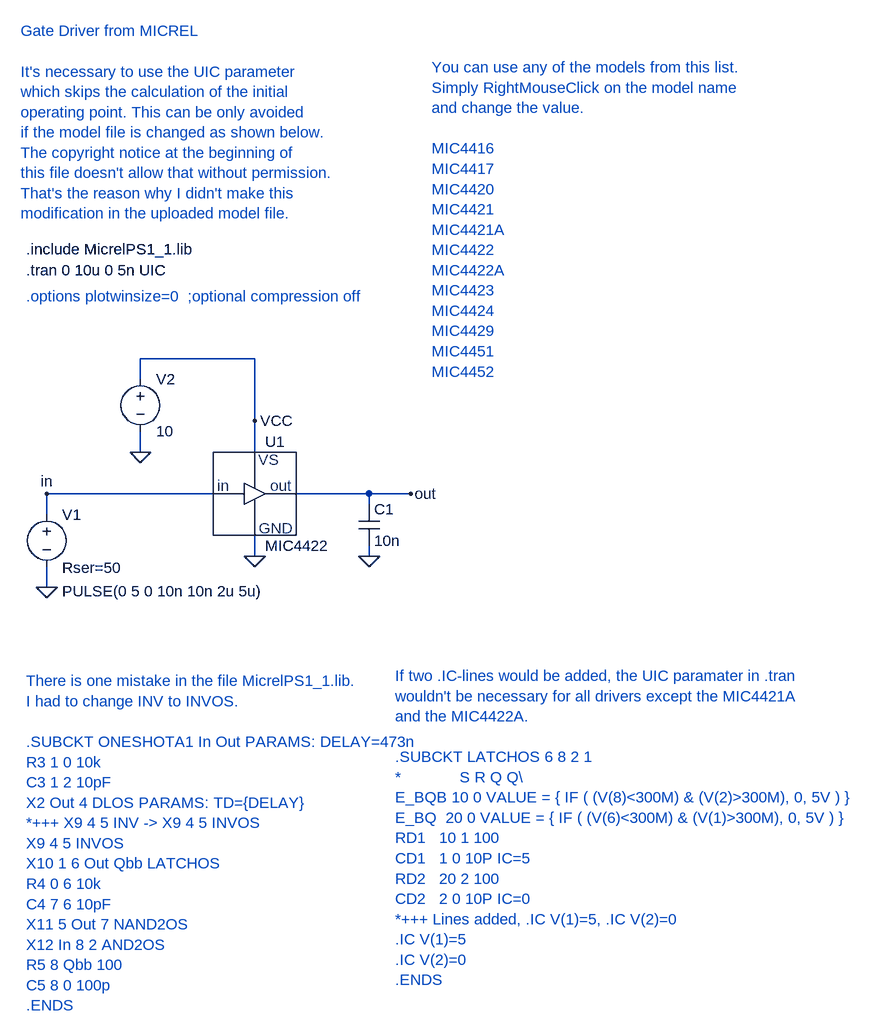
[diagram p0: schematic MIC4422_test.asc]
MIC4422_test.asc, the LTspice schematic file:
Version 4
SHEET 1 1212 960
WIRE -128 240 -128 208
WIRE -128 352 -128 320
WIRE 16 32 16 0
WIRE 16 144 16 112
WIRE 128 208 -128 208
WIRE 192 0 16 0
WIRE 192 96 192 0
WIRE 192 144 192 96
WIRE 192 304 192 272
WIRE 368 208 256 208
WIRE 368 224 368 208
WIRE 368 304 368 288
WIRE 432 208 368 208
FLAG 192 304 0
FLAG 192 96 VCC
FLAG -128 352 0
FLAG 368 304 0
FLAG 432 208 out
FLAG -128 208 in
FLAG 16 144 0
SYMBOL voltage -128 224 R0
WINDOW 3 24 134 Left 0
WINDOW 123 0 0 Left 0
WINDOW 39 24 98 Left 0
SYMATTR Value PULSE(0 5 0 10n 10n 2u 5u)
SYMATTR SpiceLine Rser=50
SYMATTR InstName V1
SYMBOL cap 352 224 R0
SYMATTR InstName C1
SYMATTR Value 10n
SYMBOL voltage 16 16 R0
SYMATTR InstName V2
SYMATTR Value 10
SYMBOL xdriver 192 208 R0
SYMATTR InstName U1
TEXT -160 -168 Left 0 !.include MicrelPS1_1.lib
TEXT -160 -136 Left 0 !.tran 0 10u 0 5n UIC
TEXT 464 -448 Left 0 ;You can use any of the models from this list.\nSimply RightMouseClick on the model name\nand change the value.\n \nMIC4416\nMIC4417\nMIC4420\nMIC4421\nMIC4421A  \nMIC4422\nMIC4422A  \nMIC4423\nMIC4424\nMIC4429\nMIC4451\nMIC4452
TEXT -160 -96 Left 0 ;.options plotwinsize=0  ;optional compression off
TEXT 408 488 Left 0 ;If two .IC-lines would be added, the UIC paramater in .tran \nwouldn't be necessary for all drivers except the MIC4421A \nand the MIC4422A.\n \n.SUBCKT LATCHOS 6 8 2 1\n*             S R Q Q\\\nE_BQB 10 0 VALUE = { IF ( (V(8)<300M) & (V(2)>300M), 0, 5V ) }\nE_BQ  20 0 VALUE = { IF ( (V(6)<300M) & (V(1)>300M), 0, 5V ) }\nRD1   10 1 100\nCD1   1 0 10P IC=5\nRD2   20 2 100\nCD2   2 0 10P IC=0\n*+++ Lines added, .IC V(1)=5, .IC V(2)=0\n.IC V(1)=5\n.IC V(2)=0\n.ENDS
TEXT -160 496 Left 0 ;There is one mistake in the file MicrelPS1_1.lib.\nI had to change INV to INVOS.\n \n.SUBCKT ONESHOTA1 In Out PARAMS: DELAY=473n\nR3 1 0 10k\nC3 1 2 10pF\nX2 Out 4 DLOS PARAMS: TD={DELAY}\n*+++ X9 4 5 INV -> X9 4 5 INVOS\nX9 4 5 INVOS\nX10 1 6 Out Qbb LATCHOS\nR4 0 6 10k\nC4 7 6 10pF\nX11 5 Out 7 NAND2OS\nX12 In 8 2 AND2OS\nR5 8 Qbb 100\nC5 8 0 100p\n.ENDS
TEXT -168 -504 Left 0 ;Gate Driver from MICREL\n \nIt's necessary to use the UIC parameter\nwhich skips the calculation of the initial \noperating point. This can be only avoided\nif the model file is changed as shown below.\nThe copyright notice at the beginning of\nthis file doesn't allow that without permission.\nThat's the reason why I didn't make this \nmodification in the uploaded model file.

The netlist it stands for:
* MIC4422_test.asc
V1 in 0 PULSE(0 5 0 10n 10n 2u 5u) Rser=50
C1 out 0 10n
V2 VCC 0 10
XU1 in out VCC 0 MIC4422  ; pins in out VS VCOM
.include MicrelPS1_1.lib
.tran 0 10u 0 5n UIC
* You can use any of the models from this list.
* Simply RightMouseClick on the model name
* and change the value.
* MIC4416
* MIC4417
* MIC4420
* MIC4421
* MIC4421A
* MIC4422
* MIC4422A
* MIC4423
* MIC4424
* MIC4429
* MIC4451
* MIC4452
* .options plotwinsize=0  ;optional compression off
* If two .IC-lines would be added, the UIC paramater in .tran
* wouldn't be necessary for all drivers except the MIC4421A
* and the MIC4422A.
* .SUBCKT LATCHOS 6 8 2 1
* *             S R Q Q\
* E_BQB 10 0 VALUE = { IF ( (V(8)<300M) & (V(2)>300M), 0, 5V ) }
* E_BQ  20 0 VALUE = { IF ( (V(6)<300M) & (V(1)>300M), 0, 5V ) }
* RD1   10 1 100
* CD1   1 0 10P IC=5
* RD2   20 2 100
* CD2   2 0 10P IC=0
* *+++ Lines added, .IC V(1)=5, .IC V(2)=0
* .IC V(1)=5
* .IC V(2)=0
* .ENDS
* There is one mistake in the file MicrelPS1_1.lib.
* I had to change INV to INVOS.
* .SUBCKT ONESHOTA1 In Out PARAMS: DELAY=473n
* R3 1 0 10k
* C3 1 2 10pF
* X2 Out 4 DLOS PARAMS: TD={DELAY}
* *+++ X9 4 5 INV -> X9 4 5 INVOS
* X9 4 5 INVOS
* X10 1 6 Out Qbb LATCHOS
* R4 0 6 10k
* C4 7 6 10pF
* X11 5 Out 7 NAND2OS
* X12 In 8 2 AND2OS
* R5 8 Qbb 100
* C5 8 0 100p
* .ENDS
* Gate Driver from MICREL
* It's necessary to use the UIC parameter
* which skips the calculation of the initial
* operating point. This can be only avoided
* if the model file is changed as shown below.
* The copyright notice at the beginning of
* this file doesn't allow that without permission.
* That's the reason why I didn't make this
* modification in the uploaded model file.
.backanno
.end